# EasyEDA Pro project ProPrj_NUEDC_TI-2025_Ctrller_Pltform_2025-08-02.epro, board PCB2
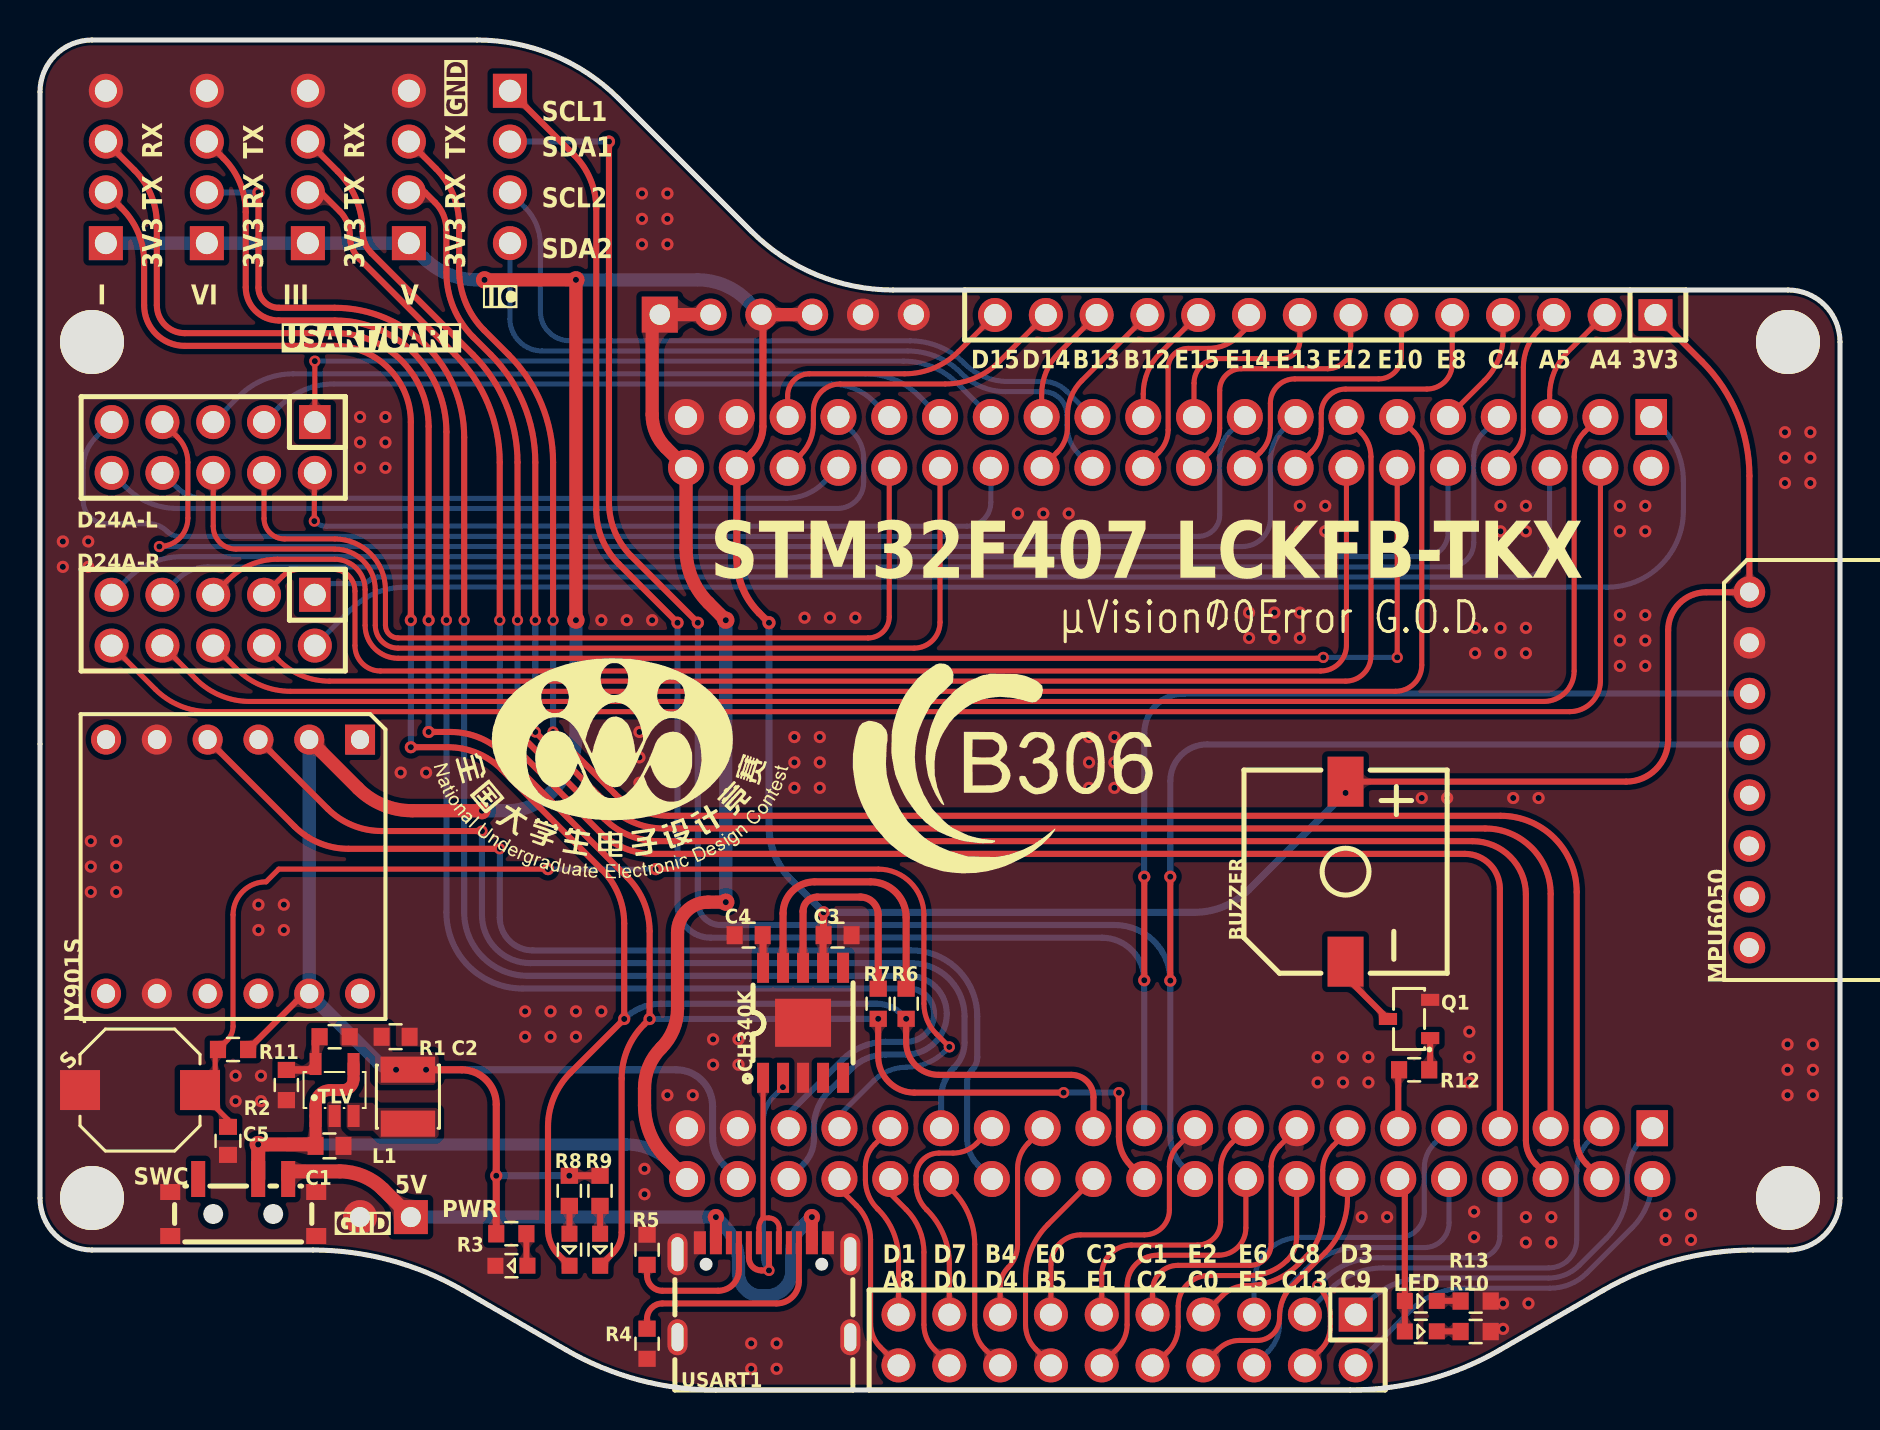
[diagram p4: board, top side]
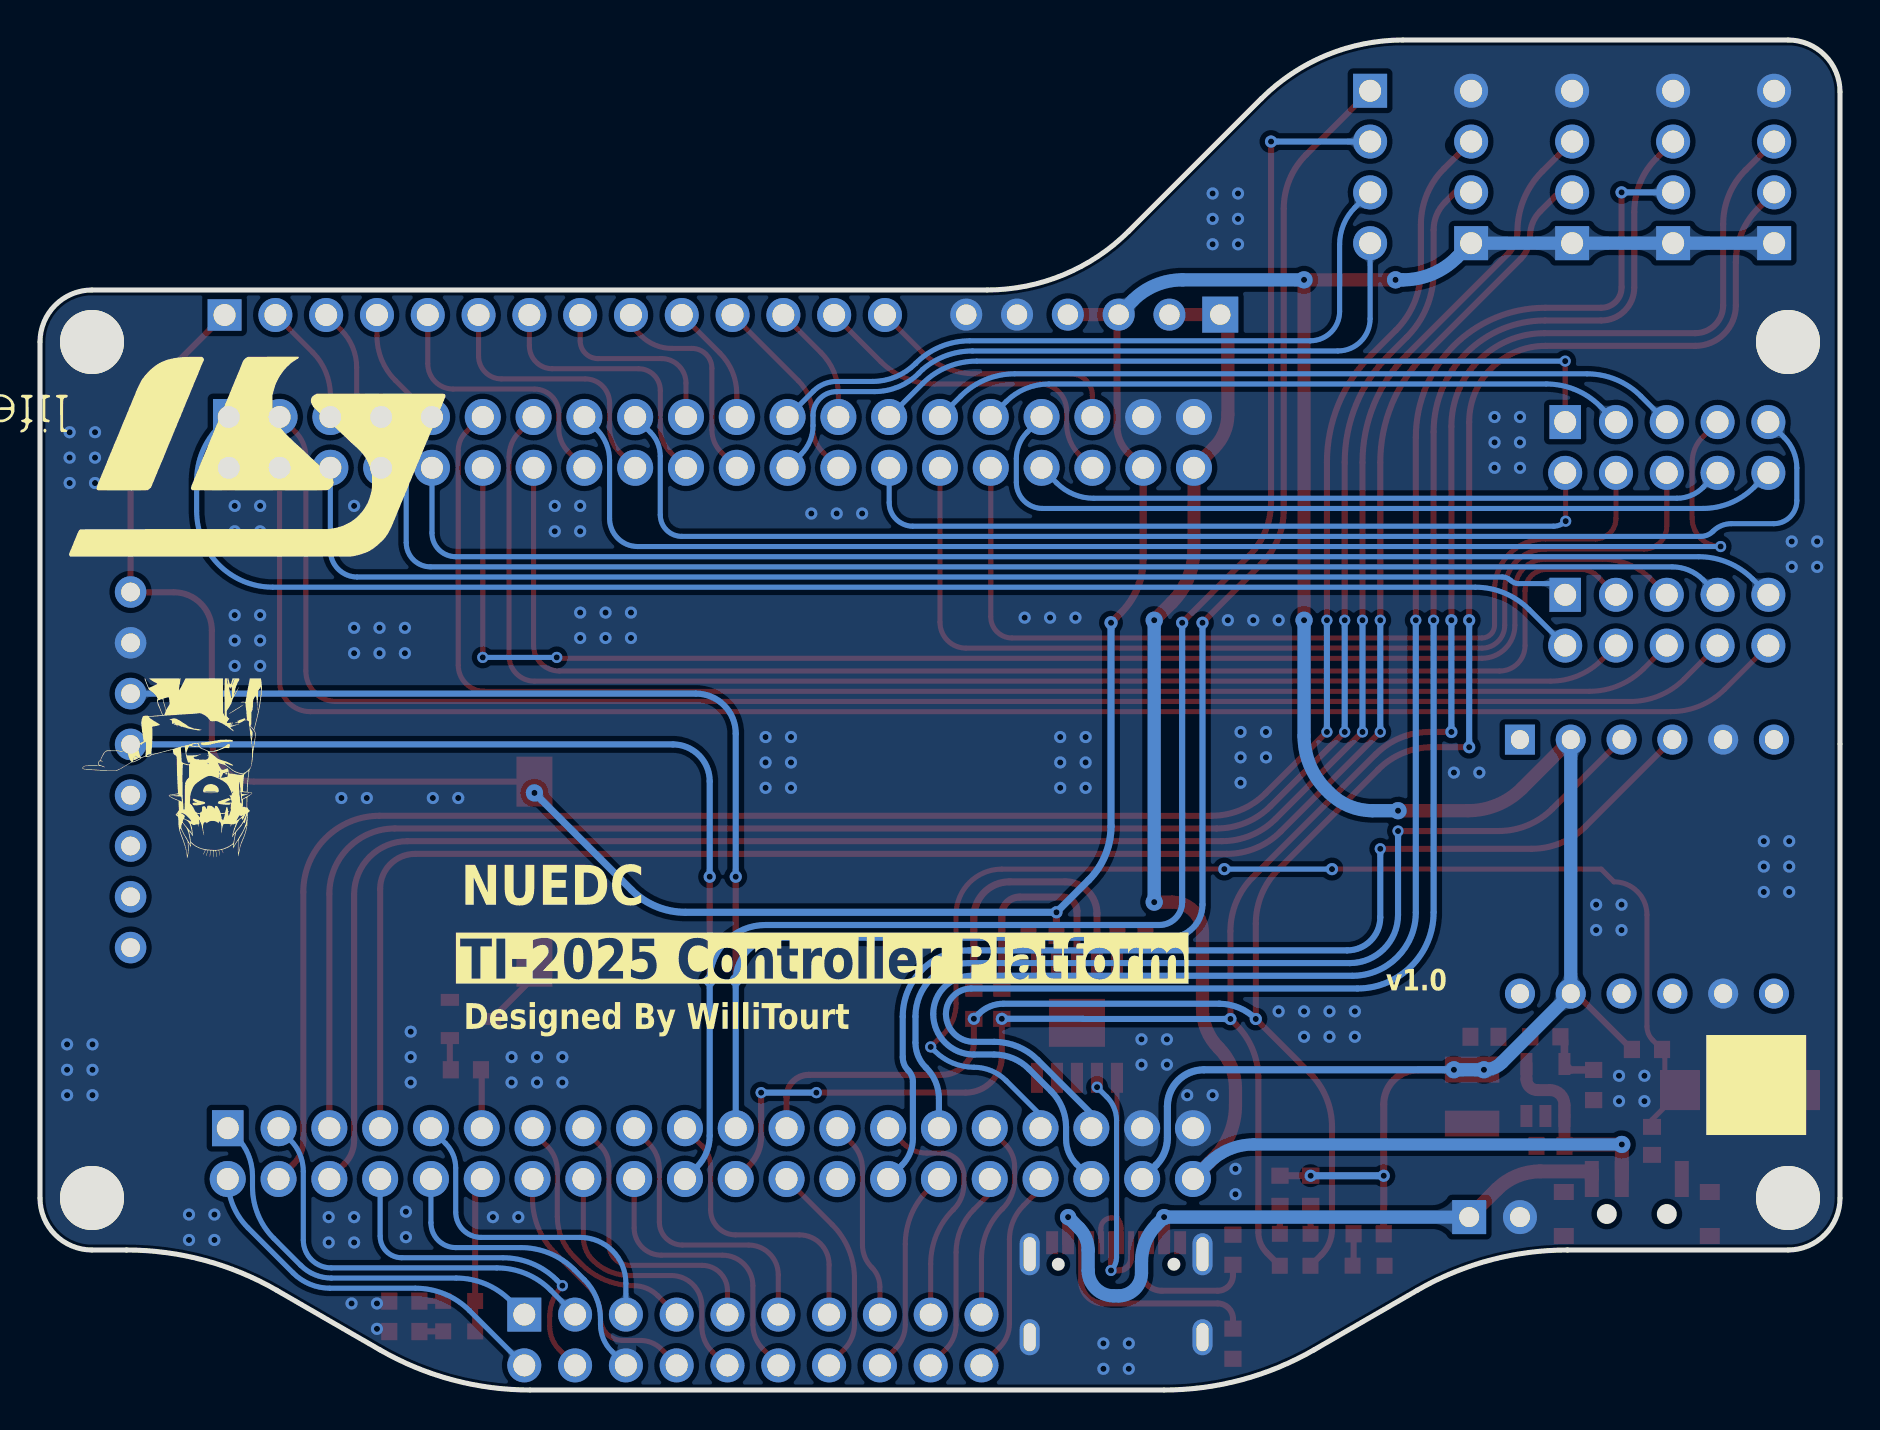
[diagram p5: board, bottom side, seen from below]

Outline 90 x 67.5 mm; copper layers: Top Layer, Bottom Layer. Coordinates in mm from the lower left corner of the outline.
Outline path: 0,64.9 arc(0.76,66.74) 2.6,67.5 21.84,67.5 arc(25.68,66.74) 28.94,64.56 35.56,57.94 arc(38.82,55.76) 42.66,55 87.4,55 arc(89.24,54.24) 90,52.4 90,9.6 arc(89.24,7.76) 87.4,7 85.67,7 arc(81.79,6.49) 78.17,4.99 73.01,2.01 arc(69.39,0.51) 65.51,0 33.79,0 arc(29.91,0.51) 26.29,2.01 21.13,4.99 arc(17.51,6.49) 13.63,7 2.6,7 arc(0.76,7.76) 0,9.6 0,64.9
Stack: Top Layer 0.035mm / Dielectric1 1.51mm FR4 er 4.5 / Bottom Layer 0.035mm

## Design rules (mm)
template: 自定义配置
spacing copperThickness1oz (default): track to track 0.102, other pairs 0.152 to 0.3
spacing copperThickness2oz: track to track 0.203, other pairs 0.152 to 0.3
track width copperThickness1oz (default): min 0.127, default 0.254, max 2.54
track width copperThickness2oz: min 0.203, default 0.254, max 2.54
differential pair differentialPair (default): width min 0.127, default 0.254, max 2.54; gap min 0.152, default 0.152
via viaSize (default): diameter min 0.5, default 0.61, max 10; hole min 0.3, default 0.305, max 6.3

## Placement (name value [footprint] x y rotation side)
BUZZER  3kHz  [BUZ-SMD_L9.6-W9.6-LS10.0-R]  65.28 25.92 90 top
C1  22uF  [C0603]  14.47 12.2 180 top
C2  22uF  [C0603]  17.78 17.66 180 top
C3  100nF  [C0603]  39.88 22.74 180 top
C4  100nF  [C0603]  35.43 22.74 180 top
C5  10uF  [C0603]  9.4 12.45 90 top
CH340K  CH340K  [ESOP-10_L4.9-W3.9-P1.00-LS6.2-BL-EP]  38.15 18.36 0 top
D24A-L  -  [HDR-TH_10P-P2.54-V-F-R2-C5-S2.54]  8.66 47.13 180 top
D24A-R  -  [HDR-TH_10P-P2.54-V-F-R2-C5-S2.54]  8.66 38.49 180 top
H1  -  [HDR-TH_14P-P2.54-V-F-1]  64.26 53.75 180 top
H2  -  [HDR-TH_20P-P2.54-V-R2-C10-S2.54]  54.36 2.5 180 top
H3  -  [HDR-TH_6P-P2.54-V-F]  37.34 53.77 0 top
IIC  -  [HDR-TH_4P-P2.54-V-F]  23.5 61.15 270 top
JY901S  -  [JY901S]  9.65 26.17 270 top
L1  2.2uH  [IND-SMD_L3.0-W3.0_FNR30XXS]  18.4 14.67 270 top
LED  -  [LED0603]  68.99 4.45 180 top
LED2  -  [LED0603]  68.99 2.92 180 top
MPU6050  -  [MPU6050]  84.2 41.5 0 top
PWR  -  [HDR-TH_2P-P2.54-V-F]  17.27 8.64 180 top
PWR#2  -  [LED0603]  23.62 6.22 0 top
Q1  S9013  [SOT-23-3_L2.9-W1.4-P1.90-LS2.6-BR]  68.45 18.55 0 top
QR  -  [JLC-QRCODE-5x5]  4.19 15.25 180 bottom
R1  453K  [R0603]  14.73 17.66 0 top
R2  100K  [R0603]  12.32 15.25 90 top
R3  4.7K  [R0603]  23.57 7.81 180 top
R4  5.1K  [R0603]  30.35 2.31 90 top
R5  5.1K  [R0603]  30.35 7.01 270 top
R6  20Ω  [R0603]  43.31 19.31 90 top
R7  20Ω  [R0603]  41.91 19.31 90 top
R8  1K  [R0603]  26.47 9.96 90 top
R9  1K  [R0603]  28 9.96 90 top
R10  1K  [R0603]  71.78 2.92 0 top
R11  10K  [R0603]  9.65 17.03 0 top
R12  1K  [R0603]  68.71 16.01 0 top
R13  1K  [R0603]  71.78 4.45 0 top
RX  -  [LED0603]  28 7.06 90 top
S  -  [6*6*5 硅胶开关]  8 11.95 180 top
SCREW1  -  [M3螺丝]  87.4 9.6 0 top
SCREW2  -  [M3螺丝]  87.4 52.4 0 top
SCREW3  -  [M3螺丝]  2.6 9.6 0 top
SCREW4  -  [M3螺丝]  2.6 52.4 0 top
SWC  MSS12C02LS-BB2.0  [SW-SMD_MSS12C02LS-HB2.0-1]  10.16 9.12 180 top
TLV  TLV62568DBVR  [SOT-23-5_L3.0-W1.7-P0.95-LS2.8-BR]  14.73 15 270 top
TX  -  [LED0603]  26.47 7.06 90 top
U1  -  [LCKFB-STM32F407-TKX]  56.46 29.6 270 top
UART5  -  [HDR-TH_4P-P2.54-V-F]  18.44 61.15 90 top
USART1  -  [USB-C-SMD_TYPE-C16PIN]  36.19 5 0 top
USART1#2  -  [HDR-TH_4P-P2.54-V-F]  3.29 61.15 90 top
USART3  -  [HDR-TH_4P-P2.54-V-F]  13.39 61.15 90 top
USART6  -  [HDR-TH_4P-P2.54-V-F]  8.34 61.15 90 top

## Footprints (pads in the part's own frame, mm; a bottom-side part is the same pattern mirrored in y, then rotated)
6*6*5 硅胶开关
  rect 2x2 smd: 1(0,-3.05) 2(6,-3.05)
BUZ-SMD_L9.6-W9.6-LS10.0-R
  rect 2.5x1.8 smd: 1(4.5,0) 2(-4.5,0)
C0603
  rect 0.8x0.9 smd: 1(-0.7,0) 2(0.7,0)
ESOP-10_L4.9-W3.9-P1.00-LS6.2-BL-EP
  rect 0.6x1.5 smd: 1(-2,-2.75) 2(-1,-2.75) 3(0,-2.75) 4(1,-2.75) 5(2,-2.75) 6(2,2.75) 7(1,2.75) 8(0,2.75) 9(-1,2.75) 10(-2,2.75)
  rect 2.8x2.4 smd: 11(0,0)
HDR-TH_2P-P2.54-V-F
  rect 1.7x1.7 hole 1: 1(-1.27,0)
  round 1.7 hole 1: 2(1.27,0)
HDR-TH_4P-P2.54-V-F
  rect 1.7x1.7 hole 1.1: 1(-3.81,0)
  round 1.7 hole 1.1: 2(-1.27,0) 3(1.27,0) 4(3.81,0)
HDR-TH_6P-P2.54-V-F
  rect 1.8x1.8 hole 1.02: 1(-6.35,0)
  round 1.6 hole 1.02: 2(-3.81,0) 3(-1.27,0) 4(1.27,0) 5(3.81,0) 6(6.35,0)
HDR-TH_10P-P2.54-V-F-R2-C5-S2.54
  rect 1.575x1.7 hole 1.1: 1(-5.08,-1.27)
  round 1.7 hole 1.1: 2(-5.08,1.27) 3(-2.54,-1.27) 4(-2.54,1.27) 5(0,-1.27) 6(0,1.27) 7(2.54,-1.27) 8(2.54,1.27) 9(5.08,-1.27) 10(5.08,1.27)
HDR-TH_14P-P2.54-V-F-1
  rect 1.7x1.575 hole 1.1: 1(-16.51,0)
  round 1.7 hole 1.1: 2(-13.97,0) 3(-11.43,0) 4(-8.89,0) 5(-6.35,0) 6(-3.81,0) 7(-1.27,0) 8(1.27,0) 9(3.81,0) 10(6.35,0) 11(8.89,0) 12(11.43,0) 13(13.97,0) 14(16.51,0)
HDR-TH_20P-P2.54-V-R2-C10-S2.54
  rect 1.7x1.7 hole 1.1: 1(-11.43,-1.27)
  round 1.7 hole 1.1: 2(-11.43,1.27) 3(-8.89,-1.27) 4(-8.89,1.27) 5(-6.35,-1.27) 6(-6.35,1.27) 7(-3.81,-1.27) 8(-3.81,1.27) 9(-1.27,-1.27) 10(-1.27,1.27) 11(1.27,-1.27) 12(1.27,1.27) 13(3.81,-1.27) 14(3.81,1.27) 15(6.35,-1.27) 16(6.35,1.27) 17(8.89,-1.27) 18(8.89,1.27) 19(11.43,-1.27) 20(11.43,1.27)
IND-SMD_L3.0-W3.0_FNR30XXS
  rect 1.3x2.72 smd: 1(1.35,0) 2(-1.35,0)
JY901S
  rect 1.501x1.501 hole 0.945x0.899: 1(-6.35,6.35)
  round 1.501 hole 0.945x0.899: 2(-6.35,3.81) 3(-6.35,1.27) 4(-6.35,-1.27) 5(-6.35,-3.81) 6(-6.35,-6.35) 7(6.35,6.35) 8(6.35,3.81) 9(6.35,1.27) 10(6.35,-1.27) 11(6.35,-3.81) 12(6.35,-6.35)
LCKFB-STM32F407-TKX
  rect 1.8x1.575 hole 1.1: 1(-19.05,24.105) 41(16.51,24.155)
  round 1.8 hole 1.1: 2(-16.51,24.105) 3(-19.05,21.564) 4(-16.51,21.564) 5(-19.05,19.024) 6(-16.51,19.024) 7(-19.05,16.485) 8(-16.51,16.485) 9(-19.05,13.944) 10(-16.51,13.944) 11(-19.05,11.405) 12(-16.51,11.405) 13(-19.05,8.864) 14(-16.51,8.864) 15(-19.05,6.324) 16(-16.51,6.324) 17(-19.05,3.784) 18(-16.51,3.784) 19(-19.05,1.244) 20(-16.51,1.244) 21(-19.05,-1.296) 22(-16.51,-1.296) 23(-19.05,-3.836) 24(-16.51,-3.836) 25(-19.05,-6.375) 26(-16.51,-6.375) 27(-19.05,-8.915) 28(-16.51,-8.915) 29(-19.05,-11.456) 30(-16.51,-11.456) 31(-19.05,-13.995) 32(-16.51,-13.995) 33(-19.05,-16.535) 34(-16.51,-16.535) 35(-19.05,-19.076) 36(-16.51,-19.076) 37(-19.05,-21.616) 38(-16.51,-21.616) 39(-19.05,-24.155) 40(-16.51,-24.155) 42(19.05,24.155) 43(16.51,21.616) 44(19.05,21.616) 45(16.51,19.076) 46(19.05,19.076) 47(16.51,16.535) 48(19.05,16.535) 49(16.51,13.995) 50(19.05,13.995) 51(16.51,11.456) 52(19.05,11.456) 53(16.51,8.915) 54(19.05,8.915) 55(16.51,6.375) 56(19.05,6.375) 57(16.51,3.836) 58(19.05,3.836) 59(16.51,1.296) 60(19.05,1.296) 61(16.51,-1.244) 62(19.05,-1.244) 63(16.51,-3.784) 64(19.05,-3.784) 65(16.51,-6.324) 66(19.05,-6.324) 67(16.51,-8.864) 68(19.05,-8.864) 69(16.51,-11.405) 70(19.05,-11.405) 71(16.51,-13.944) 72(19.05,-13.944) 73(16.51,-16.485) 74(19.05,-16.485) 75(16.51,-19.024) 76(19.05,-19.024) 77(16.51,-21.564) 78(19.05,-21.564) 79(16.51,-24.105) 80(19.05,-24.105)
LED0603
  rect 0.8x0.8 smd: 1(-0.851,-0.01) 2(0.75,-0.005)
M3螺丝
  round 3.2 hole 3.2: 1(0,0)
MPU6050
  round 1.575 hole 0.94: 1(1.27,-1.6) 2(1.27,-4.14) 3(1.27,-6.68) 4(1.27,-9.22) 5(1.27,-11.76) 6(1.27,-14.3) 7(1.27,-16.84) 8(1.27,-19.38)
R0603
  rect 0.806x0.864 smd: 1(-0.753,0) 2(0.753,0)
SOT-23-3_L2.9-W1.4-P1.90-LS2.6-BR
  rect 0.91x0.6 smd: 1(1.055,-0.955) 2(1.055,0.955) 3(-1.055,0)
SOT-23-5_L3.0-W1.7-P0.95-LS2.8-BR
  rect 1.1x0.6 smd: 1(1.3,-0.95) 2(1.3,0) 3(1.3,0.95) 4(-1.3,0.95) 5(-1.3,-0.95)
SW-SMD_MSS12C02LS-HB2.0-1
  rect 0.7x1.8 smd: 1(-2.25,-1.425) 2(-0.75,-1.425) 3(2.25,-1.425)
  rect 1x0.8 smd: 4(-3.65,1.425) 4(-3.65,-0.775) 4(3.65,1.425) 4(3.65,-0.775)
USB-C-SMD_TYPE-C16PIN
  oval 1x2.1 hole 0.6x1.7: 1(-4.32,1.788) 2(4.32,1.788)
  oval 1x1.8 hole 0.6x1.4: 3(-4.32,-2.362) 4(4.32,-2.362)
  rect 0.6x1.15 smd: A1B12(-3.2,2.362) A4B9(-2.4,2.362) B1A12(3.2,2.362) B4A9(2.4,2.362)
  rect 0.3x1.15 smd: A5(-1.25,2.362) A6(-0.25,2.362) A7(0.25,2.362) A8(1.25,2.362) B5(1.75,2.362) B6(0.75,2.362) B7(-0.75,2.362) B8(-1.75,2.362)

## Nets
3V3: BUZZER.1 C2.2 C3.2 CH340K.7 H1.1 H3.3 H3.4 JY901S.2 JY901S.8 L1.2 MPU6050.1 R1.2 R3.2 R8.2 R9.2 R11.2 U1.38 U1.78 UART5.1 USART1#2.1 USART3.1 USART6.1
5V: C1.2 H3.1 H3.2 SWC.2 TLV.1 TLV.4 U1.40 U1.80
5VIN: PWR.1 SWC.1 USART1.A4B9 USART1.B4A9
GND: C1.1 C2.1 C3.1 C4.2 C5.1 CH340K.3 CH340K.11 H3.5 H3.6 JY901S.5 JY901S.11 MPU6050.2 PWR.2 PWR#2.1 Q1.2 R2.1 R4.1 R5.1 R10.2 R13.2 S.2 SCREW1.1 SCREW2.1 SCREW3.1 SCREW4.1 SWC.4 TLV.2 U1.37 U1.39 U1.77 U1.79 UART5.4 USART1.1 USART1.2 USART1.3 USART1.4 USART1.A1B12 USART1.B1A12 USART1#2.4 USART3.4 USART6.4
A4: H1.2 U1.5
A5: H1.3 U1.8
A8: H2.20 U1.74
B4: H2.15 U1.65
B5: H2.14 U1.64
B12: H1.11 U1.26
B13: H1.12 U1.25
BUZZER: R12.1 U1.51
C0: H2.8 U1.54
C1: H2.9 U1.55
C2: H2.10 U1.56
C3: H2.11 U1.57
C4: H1.4 U1.9
C8: H2.3 U1.43
C9: H2.2 U1.42
C13: H2.4 U1.48
D0: H2.18 U1.72
D1: H2.19 U1.71
D3: H2.1 U1.41
D4: H2.16 U1.70
D7: H2.17 U1.67
D14: H1.13 U1.36
D15: H1.14 U1.35
DIR.BL.IN1: D24A-L.6 U1.30
DIR.BL.IN2: D24A-L.4 U1.32
DIR.BR.IN1: D24A-R.5 U1.12
DIR.BR.IN2: D24A-R.3 U1.14
DIR.FL.IN1: D24A-L.5 U1.29
DIR.FL.IN2: D24A-L.3 U1.31
DIR.FR.IN1: D24A-R.6 U1.11
DIR.FR.IN2: D24A-R.4 U1.13
E0: H2.13 U1.59
E1: H2.12 U1.58
E2: H2.7 U1.53
E5: H2.6 U1.50
E6: H2.5 U1.49
E8: H1.5 U1.16
E10: H1.6 U1.18
E12: H1.7 U1.20
E13: H1.8 U1.19
E14: H1.9 U1.22
E15: H1.10 U1.21
ENC.BL.A: D24A-L.8 U1.34
ENC.BL.B: D24A-L.10 U1.33
ENC.BR.A: D24A-R.7 U1.7
ENC.BR.B: D24A-R.9 U1.10
ENC.FL.A: D24A-L.7 U1.15
ENC.FL.B: D24A-L.9 U1.17
ENC.FR.A: D24A-R.8 U1.3
ENC.FR.B: D24A-R.10 U1.4
I2C1.SCL: IIC.1 MPU6050.3 U1.61
I2C1.SDA: IIC.2 MPU6050.4 U1.60
I2C2.SCL: IIC.3 U1.23
I2C2.SDA: IIC.4 U1.24
LED: LED.2 LED2.2 U1.52
PWM0: D24A-L.2 U1.28
PWM1: D24A-L.1 U1.27
PWM2: D24A-R.2 U1.1
PWM3: D24A-R.1 U1.6
S: C5.2 R11.1 S.1 U1.73
UART5.RX: U1.45 UART5.2
UART5.TX: U1.44 UART5.3
UD+: CH340K.1 USART1.A6 USART1.B6
UD-: CH340K.2 USART1.A7 USART1.B7
USART1.RX: R7.1 RX.1 U1.62 USART1#2.3
USART1.TX: R6.1 TX.1 U1.63 USART1#2.2
USART2.RX: JY901S.4 U1.68
USART2.TX: JY901S.3 U1.69
USART3.RX: U1.46 USART3.3
USART3.TX: U1.47 USART3.2
USART6.RX: U1.76 USART6.2
USART6.TX: U1.75 USART6.3
$1N2281: C4.1 CH340K.10
$1N2282: CH340K.9 R6.2
$1N2283: CH340K.8 R7.2
$1N2289: R8.1 TX.2
$1N2292: R9.1 RX.2
$1N2301: R4.2 USART1.B5
$1N2302: R5.2 USART1.A5
$1N2368: LED.1 R13.1
$1N2391: BUZZER.2 Q1.3
$1N2476: LED2.1 R10.1
$1N2481: Q1.1 R12.2
$1N2556: R1.1 R2.2 TLV.5
$1N2557: PWR#2.2 R3.1
$1N2559: L1.1 TLV.3

Pads without a net: CH340K 4 5 6; JY901S 1 6 7 9 10 12; MPU6050 5 6 7 8; SWC 3; U1 2 66; USART1 A8 B8

## Via types
v1: diameter 0.864, hole 0.305, Top Layer to Bottom Layer, 10 vias
v2: diameter 0.61, hole 0.305, Top Layer to Bottom Layer, 168 vias
v3: diameter 0.66, hole 0.305, Top Layer to Bottom Layer, 1 via
v4: diameter 0.559, hole 0.305, Top Layer to Bottom Layer, 23 vias
v5: diameter 0.813, hole 0.305, Top Layer to Bottom Layer, 2 vias

## Routing (per net, layer and track width the routed paths; a pad name or vN(x,y) marks a point on that pad's centre or on a via; arc(x,y) is an arc through that point)
3V3: length 243.3
  Top Layer w0.305: R11.2 13.01,19.64 arc(13.22,19.77) 13.46,19.82 ; BUZZER.1 79.3,30.42 arc(80.79,31.03) 81.41,32.52 81.41,37.98 arc(81.96,39.33) 83.31,39.89 85.46,39.89 arc(85.47,39.89) MPU6050.1 85.47,45.7 arc(84.86,48.8) 83.1,51.42 H1.1
  Top Layer w0.355: v2(39.18,23.89) C3.2 arc(39.16,22.71) 39.15,22.68 CH340K.7 ; R3.2 v2(22.81,10.71) 22.81,14.28 arc(22.31,15.5) 21.08,16.01 v1(19.3,16.01) 18.4,16.01 arc(18.4,16.01) L1.2 ; v3(36.45,38.36) 35.96,38.85 arc(35.13,40.09) 34.84,41.55 U1.38 35.61,46.87 arc(36.01,47.47) 36.15,48.18 36.15,53.58 arc(36.13,53.68) H3.3 ; v2(26.47,10.71) 28,10.71
  Top Layer w0.66: H3.3 H3.4 ; v1(22.1,28.97) 18.6,28.97 arc(17.14,29.26) 15.9,30.08 JY901S.2 ; v1(22.22,55.51) v1(26.8,55.51) v1(26.8,38.49)
  Bottom Layer w0.355: v3(36.45,38.36) 36.45,28.19 arc(36.74,26.73) 37.56,25.5 v2(39.18,23.89) 57.73,23.89 arc(59.19,24.18) 60.43,25 v1(65.28,29.85) ; U1.78 34.19,11.25 arc(33.78,11.87) 33.63,12.61 33.63,14.19 arc(33.1,15.48) 31.81,16.01 v1(19.3,16.01) ; v2(22.81,10.71) v2(26.47,10.71)
  Bottom Layer w0.66: v1(22.22,55.51) 21.86,55.51 arc(20.4,55.8) 19.16,56.62 UART5.1 USART3.1 USART6.1 USART1#2.1 ; JY901S.2 13.46,19.82 16.9,16.39 arc(17.31,16.11) v1(17.8,16.01) v1(19.3,16.01) ; v1(22.1,28.97) 23.38,28.97 arc(24.54,29.2) 25.53,29.85 25.68,30.01 arc(26.51,31.24) 26.8,32.7 v1(26.8,38.49) ; v1(26.8,55.51) 32.88,55.51 arc(34.22,55.24) 35.35,54.48 H3.3
5V: length 82.2
  Top Layer w0.6: 15.68,16.3 15.68,15.54 arc(15.52,15.16) 15.13,15 14.5,15 arc(13.99,14.78) 13.78,14.27 TLV.1 13.78,12.21 arc(13.78,12.21) C1.2
  Top Layer w0.66: v1(34.29,24.39) 33.4,24.39 arc(32.32,23.95) 31.88,22.87 31.88,19.07 arc(31.66,18) 31.06,17.1 arc(30.44,16.18) 30.23,15.09 30.23,14.23 arc(30.51,12.8) 31.33,11.58 U1.80 ; v1(34.29,38.49) 33.42,39.36 arc(32.59,40.6) 32.3,42.06 U1.40 31.29,47.12 arc(30.79,47.88) 30.61,48.78 30.61,53.39 H3.1 H3.2
  Top Layer w0.701: SWC.2 v1(10.91,12.28) 13.7,12.28 arc(13.75,12.26) C1.2
  Bottom Layer w0.61: v1(10.91,12.28) 29.32,12.28 arc(30.53,12.04) 31.55,11.35 U1.80
  Bottom Layer w0.66: v1(34.29,38.49) v1(34.29,24.39)
5VIN: length 35.4
  Top Layer w0.6: USART1.A4B9 v5(33.79,8.64) ; USART1.B4A9 v5(38.59,8.64)
  Top Layer w0.701: PWR.1 17.15,10.03 arc(16.16,10.7) 14.99,10.93 12.41,10.93 SWC.1
  Bottom Layer w0.66: PWR.1 v5(33.79,8.64) arc(33.8,8.63) 33.8,8.62 34.16,8.26 arc(34.73,7.42) 34.93,6.42 34.93,5.85 arc(35.26,5.04) 36.07,4.71 36.32,4.71 arc(37.22,5.08) 37.59,5.98 37.59,6.99 arc(37.71,7.59) 38.05,8.1 v5(38.59,8.64)
GND:
  vias: v2(1.14,42.43) v2(1.14,41.16) v2(2.41,42.43) v2(2.41,41.16) v2(2.54,27.44) v2(2.54,26.17) v2(2.54,24.9) v2(3.81,27.44) v2(3.81,26.17) v2(3.81,24.9) v2(9.78,15.71) v2(9.78,14.44) v2(10.92,24.27) v2(10.92,23) v2(11.05,15.71) v2(11.05,14.44) v2(12.19,24.27) v2(12.19,23) v2(16,48.65) v2(16,47.38) v2(16,46.11) v2(17.27,48.65) v2(17.27,47.38) v2(17.27,46.11) v2(18.03,30.87) v2(19.3,30.87) v2(24.26,18.93) v2(24.26,17.66) v2(25.53,18.93) v2(25.53,17.66) v2(26.8,18.93) v2(26.8,17.66) v2(28.07,38.49) v2(28.07,18.93) v2(28.7,32.9) v2(28.7,31.63) v2(29.34,38.49) v2(29.97,32.9) v2(29.97,31.63) v2(29.97,30.36) v2(30.1,59.83) v2(30.1,58.56) v2(30.1,57.29) v2(30.23,11.06) v2(30.23,9.79) v2(30.61,38.49) v2(31.37,59.83) v2(31.37,58.56) v2(31.37,57.29) v2(31.37,14.74) v2(32.64,14.74) v2(33.66,17.53) v2(33.66,16.27) v2(34.93,17.53) v2(34.93,16.27) v2(35.56,2.33) v2(35.56,1.06) v2(36.83,2.33) v2(36.83,1.06) v2(37.72,32.65) v2(37.72,31.38) v2(37.72,30.11) v2(38.23,38.62) v2(38.99,32.65) v2(38.99,31.38) v2(38.99,30.11) v2(39.5,38.62) v2(40.77,38.62) v2(48.9,43.82) v2(50.16,43.82) v2(51.44,43.82) v2(52.45,32.65) v2(52.45,31.38) v2(52.45,30.11) v2(53.72,32.65) v2(53.72,31.38) v2(53.72,30.11) v2(60.45,38.87) v2(60.45,37.6) v2(61.72,38.87) v2(61.72,37.6) v2(62.99,44.2) v2(62.99,42.94) v2(62.99,38.87) v2(62.99,37.6) v2(63.88,16.65) v2(63.88,15.38) v2(64.26,44.2) v2(64.26,42.94) v2(65.15,16.65) v2(65.15,15.38) v2(66.09,8.64) v2(66.42,16.65) v2(66.42,15.38) v2(67.36,8.64) v2(69.09,29.6) v2(70.36,29.6) v2(71.47,17.92) v2(71.47,16.65) v2(71.47,15.38) v2(71.71,8.91) v2(71.71,7.64) v2(71.75,38.11) v2(71.75,36.84) v2(73.03,44.2) v2(73.03,42.94) v2(73.03,38.11) v2(73.03,36.84) v2(73.15,4.33) v2(73.15,3.06) v2(73.66,29.6) v2(74.29,44.2) v2(74.29,42.94) v2(74.29,38.11) v2(74.29,36.84) v2(74.29,8.64) v2(74.29,7.38) v2(74.42,4.33) v2(74.93,29.6) v2(75.56,8.64) v2(75.56,7.38) v2(78.99,44.2) v2(78.99,42.94) v2(78.99,38.74) v2(78.99,37.47) v2(78.99,36.2) v2(80.26,44.2) v2(80.26,42.94) v2(80.26,38.74) v2(80.26,37.47) v2(80.26,36.2) v2(81.28,8.77) v2(81.28,7.5) v2(82.55,8.77) v2(82.55,7.5) v2(87.25,47.89) v2(87.25,46.62) v2(87.25,45.35) v2(87.38,17.28) v2(87.38,16.01) v2(87.38,14.74) v2(88.52,47.89) v2(88.52,46.62) v2(88.52,45.35) v2(88.65,17.28) v2(88.65,16.01) v2(88.65,14.74)
A4: length 6.1
  Top Layer w0.254: H1.2 76.37,51.89 arc(75.71,50.9) 75.48,49.74 U1.5
A5: length 8.6
  Top Layer w0.254: U1.8 73.69,46.86 arc(74.04,47.39) 74.17,48.02 74.17,51.13 arc(74.37,52.14) 74.94,53 H1.3
A8: length 10.3
  Top Layer w0.254: H2.20 42.01,2.14 arc(41.65,2.68) 41.53,3.31 41.53,7.52 arc(41.34,8.44) 40.82,9.23 40.31,9.74 arc(40.06,10.11) U1.74
B4: length 10
  Top Layer w0.254: H2.15 48.01,5.15 arc(48.11,5.68) 48.41,6.13 arc(48.76,6.65) 48.88,7.26 48.88,11.06 arc(49.01,11.75) 49.4,12.33 50.11,13.04 arc(50.13,13.06) U1.65
B5: length 11
  Top Layer w0.254: U1.64 50.39,8.27 arc(49.57,7.03) 49.28,5.57 49.28,3.28 arc(49.41,2.6) 49.79,2.04 50.51,1.31 arc(50.54,1.28) H2.14
B12: length 9.6
  Top Layer w0.254: U1.26 50.85,46.88 arc(51.24,47.46) 51.37,48.14 51.37,48.74 arc(51.56,49.68) 52.09,50.47 H1.11
B13: length 6.1
  Top Layer w0.254: U1.25 50.08,49.77 arc(50.31,50.91) 50.95,51.87 H1.12
BUZZER: length 2.9
  Top Layer w0.305: U1.51 67.91,15.91 arc(67.92,15.97) R12.1
C0: length 13
  Top Layer w0.254: 65.37,10.55 65.37,9.56 arc(65.08,8.1) 64.26,6.86 62.6,5.21 arc(62.14,4.51) 61.98,3.69 61.98,3.59 arc(61.65,2.8) 60.87,2.48 59.98,2.48 arc(59.41,2.36) 58.93,2.04 58.2,1.31 arc(58.18,1.28) H2.8
C1: length 14.7
  Top Layer w0.254: H2.9 55.63,4.96 arc(56,5.86) 56.9,6.23 60.5,6.23 arc(61.24,6.54) 61.55,7.29 61.55,11.18 arc(61.66,11.73) 61.98,12.2 62.81,13.04 arc(62.83,13.06) U1.55
C2: length 14.2
  Top Layer w0.254: U1.56 62.83,7.64 arc(62.71,7.01) 62.36,6.49 arc(61.51,5.92) 60.52,5.72 58.44,5.72 arc(57.36,5.28) 56.91,4.19 56.91,3.17 arc(56.77,2.49) 56.39,1.91 55.76,1.28 arc(55.7,1.24) H2.10
C3: length 14.6
  Top Layer w0.254: H2.11 53.09,5.76 arc(53.52,6.81) 54.57,7.25 57.88,7.25 arc(58.69,7.59) 59.03,8.4 59.03,11.05 arc(59.17,11.74) 59.56,12.33 60.27,13.04 arc(60.29,13.06) U1.57
C4: length 6.1
  Top Layer w0.254: U1.9 72.24,50.48 arc(72.91,51.5) 73.15,52.7 H1.4
C8: length 21.2
  Bottom Layer w0.254: H2.3 64.47,4.99 arc(65.7,5.81) 67.16,6.1 75.44,6.1 arc(76.43,6.51) 76.84,7.5 76.84,10.93 arc(77,11.78) 77.49,12.5 U1.43
C9: length 19.1
  Bottom Layer w0.254: H2.2 68.53,3.97 arc(69.76,4.8) 71.22,5.09 75.5,5.09 arc(76.5,5.29) 77.34,5.85 79.6,8.11 arc(80.35,9.23) U1.42
C13: length 17.6
  Top Layer w0.254: H2.4 64.03,2.02 arc(64.39,2.55) 64.52,3.18 64.52,3.68 arc(64.35,4.51) v4(63.88,5.22)
  Bottom Layer w0.254: U1.48 72.99,7.69 arc(72.68,6.93) 71.92,6.61 66.86,6.61 arc(65.4,6.32) 64.16,5.5 v4(63.88,5.22)
D0: length 10.3
  Top Layer w0.254: U1.72 42.51,9.82 43.31,9.03 arc(43.96,8.04) 44.2,6.88 44.2,3.27 arc(44.33,2.6) 44.7,2.04 45.43,1.31 arc(45.46,1.28) H2.18
D1: length 10.2
  Top Layer w0.254: H2.19 42.93,6.57 arc(42.66,7.9) 41.91,9.03 41.87,9.07 arc(41.42,9.73) 41.27,10.51 41.27,11.16 arc(41.39,11.77) 41.73,12.28 42.49,13.04 arc(42.51,13.06) U1.71
D3: length 20
  Bottom Layer w0.254: U1.41 80.19,12.66 arc(79.59,11.76) 79.38,10.7 79.38,10.15 arc(79.1,8.76) 78.31,7.58 76.96,6.23 arc(76.26,5.76) 75.43,5.6 69.19,5.6 arc(67.73,5.31) 66.5,4.48 H2.1
D4: length 10.3
  Top Layer w0.254: U1.70 45.62,9.98 arc(46.45,8.75) 46.74,7.29 46.74,3.27 arc(46.87,2.6) 47.24,2.04 47.97,1.31 arc(48,1.28) H2.16
D7: length 12.3
  Top Layer w0.254: 47.59,13.09 46.84,12.33 arc(46.3,11.97) 45.66,11.85 44.95,11.85 arc(44.14,11.51) 43.81,10.71 43.81,10.27 arc(43.94,9.6) 44.32,9.03 44.35,9 arc(45.18,7.76) 45.47,6.31 H2.17
D14: length 16.9
  Top Layer w0.254: H1.13 47.96,51.42 arc(46.72,50.59) 45.26,50.3 40,50.3 arc(39.06,49.91) 38.67,48.97 38.67,48.3 arc(38.5,47.47) 38.03,46.76 U1.36
D15: length 13.1
  Top Layer w0.254: U1.35 37.38,49.72 arc(37.7,50.49) 38.47,50.81 43.23,50.81 arc(44.69,51.1) 45.93,51.92 H1.14
DIR.BL.IN1: length 51.7
  Top Layer w0.254: U1.30 45,38.39 arc(44.62,37.47) 43.7,37.09 17.91,37.09 arc(17.1,37.43) 16.76,38.24 16.76,40.01 arc(16.17,41.45) 14.73,42.05 9.8,42.05 arc(8.99,42.38) 8.66,43.18 D24A-L.6
DIR.BL.IN2: length 45.8
  Top Layer w0.254: U1.32 42.46,38.66 arc(42.15,37.91) 41.4,37.6 17.91,37.6 arc(17.46,37.79) 17.27,38.24 17.27,40.01 arc(16.53,41.81) 14.73,42.55 12.22,42.55 arc(11.5,42.85) 11.2,43.58 D24A-L.4
DIR.BR.IN1: length 72.9
  Top Layer w0.254: U1.12 v4(67.86,36.63) ; D24A-R.5 9.42,40.52 arc(10.55,41.27) 11.87,41.54 14.73,41.54 arc(15.81,41.09) 16.26,40.01 16.26,38.24 arc(16.74,37.07) 17.91,36.58 64.12,36.58 arc(64.15,36.6) v4(64.16,36.63)
  Bottom Layer w0.254: v4(64.16,36.63) v4(67.86,36.63)
DIR.BR.IN2: length 68.3
  Top Layer w0.254: D24A-R.3 12.13,40.69 arc(12.2,40.75) 12.27,40.81 arc(12.59,40.97) 12.95,41.03 14.67,41.03 arc(15.43,40.71) 15.75,39.95 15.75,37.22 arc(16.12,36.32) 17.02,35.95 64.04,35.95 arc(64.95,36.33) 65.32,37.24 U1.14
DIR.FL.IN1: length 37.9
  Bottom Layer w0.254: D24A-L.5 9.96,49.69 arc(11.19,50.52) 12.65,50.81 41.26,50.81 arc(42.72,50.52) 43.96,49.69 U1.29
DIR.FL.IN2: length 32.4
  Bottom Layer w0.254: U1.31 41.7,49.42 arc(40.72,50.07) 39.56,50.3 14.68,50.3 arc(13.23,50.01) 11.99,49.19 D24A-L.3
DIR.FR.IN1: length 74.9
  Top Layer w0.254: D24A-R.6 9.83,36.05 arc(11.07,35.22) 12.53,34.93 67.78,34.93 arc(68.7,35.32) 69.09,36.24 69.09,46.97 arc(68.99,47.47) 68.71,47.89 68,48.59 arc(67.94,48.63) U1.11
DIR.FR.IN2: length 69
  Top Layer w0.254: D24A-R.4 11.92,36.5 arc(13.09,35.72) 14.47,35.44 65.28,35.44 arc(66.18,35.81) 66.55,36.71 66.55,46.66 arc(66.42,47.33) 66.04,47.89 65.35,48.57 arc(65.33,48.61) U1.13
E0: length 14.5
  Top Layer w0.254: H2.13 50.55,6.27 arc(50.98,7.32) 52.03,7.76 55.22,7.76 arc(56.1,8.12) 56.47,9 56.47,11.17 arc(56.58,11.73) 56.9,12.2 57.73,13.04 arc(57.75,13.06) U1.59
E1: length 14.5
  Top Layer w0.254: U1.58 60.29,8.11 arc(59.89,7.14) 58.93,6.74 55.88,6.74 arc(54.8,6.29) 54.36,5.22 54.36,3.27 arc(54.22,2.6) 53.85,2.04 53.12,1.31 arc(53.1,1.28) H2.12
E2: length 13.2
  Top Layer w0.254: H2.7 59.11,4.71 arc(59.67,5.09) 60.32,5.22 arc(61.73,5.5) 62.93,6.29 63.31,6.68 arc(63.92,7.59) 64.13,8.67 64.13,10.97 arc(64.27,11.64) 64.64,12.2 65.26,12.82 arc(65.34,12.94) 65.37,13.09
E5: length 16
  Bottom Layer w0.254: H2.6 61.42,1.94 arc(61.83,2.56) 61.98,3.29 61.98,3.56 arc(62.19,4.62) 62.78,5.52 63.27,6 arc(64.51,6.83) 65.97,7.12 69.22,7.12 arc(70.09,7.48) 70.45,8.36 U1.50
E6: length 16.7
  Bottom Layer w0.254: H2.5 60.71,5.34 arc(61.38,6.96) 62.99,7.63 67.94,7.63 arc(68.84,8) 69.22,8.9 69.22,11.1 arc(69.35,11.77) 69.72,12.33 70.43,13.04 arc(70.45,13.06) U1.49
E8: length 13.6
  Top Layer w0.254: H1.5 70.61,51.32 arc(70.24,50.42) 69.34,50.05 65.28,50.05 arc(64.42,49.69) 64.06,48.83 64.06,48.07 arc(63.94,47.44) 63.58,46.91 U1.16
E10: length 13.6
  Top Layer w0.254: U1.18 61.02,46.89 arc(61.39,47.44) 61.52,48.09 61.52,49.34 arc(61.88,50.2) 62.74,50.56 66.93,50.56 arc(67.74,50.89) 68.07,51.7 H1.6
E12: length 13.7
  Top Layer w0.254: U1.20 58.49,46.9 arc(58.86,47.44) 58.98,48.09 58.98,49.98 arc(59.3,50.74) 60.07,51.06 64.39,51.06 arc(65.2,51.4) 65.53,52.21 H1.7
E13: length 9.5
  Top Layer w0.254: U1.19 57.7,50.34 arc(58.06,51.21) 58.93,51.57 62.1,51.57 arc(62.73,51.83) 62.99,52.46 H1.8
E14: length 10.9
  Top Layer w0.254: H1.9 60.45,53.22 59.94,52.71 arc(59.24,52.24) 58.41,52.08 57.4,52.08 arc(56.7,51.79) 56.41,51.08 56.41,48.01 arc(56.29,47.4) 55.94,46.89 U1.22
E15: length 6.1
  Top Layer w0.254: U1.21 55.16,49.81 arc(55.38,50.91) 56,51.84 H1.10
ENC.BL.A: length 34.8
  Bottom Layer w0.254: U1.34 39.16,45.35 arc(38.32,44.78) 37.32,44.59 8.16,44.59 arc(7.45,44.73) 6.85,45.13 D24A-L.8
ENC.BL.B: length 42.6
  Bottom Layer w0.254: D24A-L.10 4.3,45.14 arc(5.47,44.35) 6.86,44.08 39.88,44.08 arc(40.8,44.46) 41.18,45.38 41.18,46.58 arc(41.04,47.29) 40.64,47.89 39.95,48.57 arc(39.93,48.61) U1.33
ENC.BR.A: length 73.5
  Bottom Layer w0.254: U1.7 72.17,47.88 arc(71.81,47.35) 71.69,46.72 71.69,42.37 arc(71.33,41.51) 70.47,41.16 8.39,41.16 arc(7.56,40.99) 6.86,40.52 6.14,39.8 arc(6.13,39.78) D24A-R.7
ENC.BR.B: length 71.4
  Bottom Layer w0.254: U1.10 70.4,42.85 arc(70.05,42.01) 69.22,41.67 7.06,41.67 arc(5.61,41.37) 4.37,40.55 D24A-R.9
ENC.FL.A: length 69.3
  Top Layer w0.254: D24A-L.7 6.87,47.65 arc(7.26,47.07) 7.39,46.38 7.39,43.6 arc(6.98,42.59) v4(5.97,42.17)
  Bottom Layer w0.254: v4(5.97,42.17) 60.11,42.17 arc(61.11,42.59) 61.52,43.58 61.52,46.48 arc(61.69,47.32) 62.17,48.03 U1.15
ENC.FL.B: length 68
  Bottom Layer w0.254: U1.17 59.48,47.89 arc(59.12,47.34) 58.99,46.69 58.99,43.76 arc(58.67,43) 57.91,42.68 6.96,42.68 arc(6.63,42.75) 6.35,42.94 arc(5.93,43.22) 5.43,43.32 3.31,43.32 arc(2.5,43.65) 2.16,44.47 2.16,46.1 arc(2.32,46.93) 2.79,47.63 3.54,48.38 arc(3.56,48.39) D24A-L.9
ENC.FR.A: length 85.6
  Top Layer w0.254: D24A-R.8 7.8,35.54 arc(9.04,34.72) 10.49,34.43 75.18,34.43 arc(76.26,34.87) 76.71,35.95 76.71,46.66 arc(76.84,47.33) 77.22,47.89 77.95,48.62 arc(77.98,48.64) U1.3
ENC.FR.B: length 87.2
  Top Layer w0.254: D24A-R.10 5.77,35.03 arc(7,34.21) 8.46,33.92 76.49,33.92 arc(77.57,34.37) 78.02,35.45 U1.4
I2C1.SCL: length 120.5
  Top Layer w0.305: v2(31.88,38.36) 28.93,41.31 arc(28.1,42.55) 27.81,44 27.81,59.07 arc(27.52,60.52) 26.7,61.76 IIC.1 ; v2(55.21,20.49) v2(55.21,25.66)
  Bottom Layer w0.305: v2(31.88,38.36) 31.88,24.27 arc(32.36,23.1) 33.53,22.61 53.09,22.61 arc(54.59,21.99) v2(55.21,20.49) 55.21,13.09 ; v2(55.21,25.66) 55.21,32.83 arc(55.8,34.24) 57.21,34.82 MPU6050.3
I2C1.SDA: length 120.8
  Top Layer w0.305: v2(28.45,62.42) 28.45,44.39 arc(28.74,42.93) 29.56,41.69 v2(32.89,38.36) ; v2(56.51,20.47) v2(56.51,25.66)
  Bottom Layer w0.305: U1.60 57.17,11.14 arc(56.68,11.86) 56.51,12.71 v2(56.51,20.47) arc(55.7,22.44) 53.73,23.25 34.04,23.25 arc(33.23,23.58) 32.89,24.39 v2(32.89,38.36) ; IIC.2 v2(28.45,62.42) ; v2(56.51,25.66) 56.51,30.44 arc(57.05,31.74) 58.36,32.28 MPU6050.4
I2C2.SCL: length 36.1
  Bottom Layer w0.254: U1.23 51.32,49.95 arc(50.79,50.3) 50.16,50.43 48.37,50.43 arc(47.21,50.66) 46.23,51.32 46.2,51.34 arc(44.96,52.17) 43.51,52.46 26.49,52.46 arc(25.45,52.89) 25.02,53.93 25.02,57.28 arc(24.82,58.28) 24.25,59.12 IIC.3
I2C2.SDA: length 36.8
  Bottom Layer w0.254: U1.24 51.94,46.79 arc(51.5,47.45) 51.35,48.22 51.35,48.74 arc(51,49.57) 50.16,49.92 48.28,49.92 arc(47.08,50.16) 46.06,50.84 45.88,51.02 arc(44.71,51.71) 43.38,51.95 25.11,51.95 arc(23.97,52.42) 23.5,53.56 IIC.4
LED: length 7.7
  Top Layer w0.305: LED2.2 LED.2 68.24,9.76 arc(68.16,10.19) U1.52
PWM0: length 38.7
  Top Layer w0.254: v4(13.72,43.44) 13.72,45.79 arc(13.72,45.83) D24A-L.2
  Bottom Layer w0.254: U1.28 47.54,44.38 arc(47.19,43.54) 46.35,43.19 14.33,43.19 arc(14,43.26) v4(13.72,43.44)
PWM1: length 37.8
  Top Layer w0.254: D24A-L.1 v4(13.74,51.44)
  Bottom Layer w0.254: v4(13.74,51.44) 43.17,51.44 arc(44.63,51.15) 45.86,50.33 U1.27
PWM2: length 76.8
  Bottom Layer w0.254: U1.1 81.05,48.16 arc(81.88,46.92) 82.17,45.47 82.17,43.95 arc(81.05,41.26) 78.36,40.14 18.24,40.14 arc(16.78,39.85) 15.55,39.03 D24A-R.2
PWM3: length 66.9
  Bottom Layer w0.254: U1.6 75.48,41.99 arc(75.09,41.04) 74.14,40.65 16.87,40.65 arc(16.66,40.61) 16.47,40.48 arc(16.29,40.36) 16.08,40.32 14.3,40.32 D24A-R.1
S: length 63.3
  Top Layer w0.254: v2(25.4,26.04) 11.94,26.04 11.3,25.41 arc(10.14,24.93) 9.65,23.76 9.65,18.18 arc(9.58,17.81) 9.37,17.5 R11.1 8.76,16.89 8.76,15.76 S.1 8,14.91 9.4,13.51 C5.2 ; v4(45.47,17.15) 44.82,17.8 arc(44.36,18.49) 44.2,19.31 44.2,23.76 arc(43.53,25.37) 41.91,26.04 v2(30.78,26.04)
  Bottom Layer w0.254: v4(45.47,17.15) 45.26,16.95 arc(44.36,16.35) 43.31,16.14 arc(42.44,15.96) 41.7,15.47 39.97,13.75 U1.73 ; v2(30.78,26.04) v2(25.4,26.04)
UART5.RX: length 95.6
  Top Layer w0.305: 75.53,13.09 75.53,24.81 arc(74.58,27.12) 72.26,28.08 31.17,28.08 arc(29.71,28.37) 28.47,29.19 v4(24.77,32.9) ; UART5.2 19.25,59.88 19.75,59.38 arc(20.17,58.75) 20.32,58.01 20.32,55.89 arc(20.67,54.13) 21.67,52.64 22.53,51.77 arc(24.18,49.3) 24.77,46.38 v4(24.77,38.49)
  Bottom Layer w0.305: v4(24.77,32.9) v4(24.77,38.49)
UART5.TX: length 101.5
  Top Layer w0.305: v4(25.65,32.9) 28.73,29.83 arc(29.96,29) 31.42,28.71 73.03,28.71 arc(75.72,27.6) 76.84,24.9 76.84,12.47 arc(76.96,11.84) 77.32,11.31 U1.44 ; UART5.3 19.8,61.07 arc(20.65,59.79) 20.95,58.28 20.95,56.02 arc(21.28,54.37) 22.21,52.98 23.42,51.77 arc(25.07,49.3) 25.65,46.38 v4(25.65,38.49)
  Bottom Layer w0.305: v4(25.65,32.9) v4(25.65,38.49)
UD+: length 10.1
  Top Layer w0.254: CH340K.1 36.15,8.6 ; 36.15,8.6 36.44,8.6 arc(36.8,8.45) 36.96,8.08 36.96,7.37 arc(36.95,7.37) USART1.B6 ; 36.15,8.6 arc(36,8.37) 35.94,8.1 USART1.A6
UD-: length 13.1
  Top Layer w0.299: USART1.B7 35.44,6.6 arc(35.63,6.16) 36.07,5.98 v4(36.45,5.98) 36.45,7.36 arc(36.45,7.36) USART1.A7
  Bottom Layer w0.254: v4(37.15,15.14) 36.66,14.65 arc(36.3,14.11) 36.17,13.48 36.17,6.65 arc(36.24,6.28) v4(36.45,5.98)
USART1.RX: length 105.8
  Top Layer w0.305: USART1#2.3 4.73,60.99 arc(5.55,59.75) 5.84,58.29 5.84,54.24 arc(6.25,53.25) 7.24,52.84 14.77,52.84 arc(18.07,51.48) 19.43,48.18 v2(19.43,38.49) ; v4(53.94,14.87) 53.94,12.67 arc(54.1,11.88) 54.54,11.22 55.21,10.55 ; RX.1 28.66,6.86 arc(28.97,7.33) 29.08,7.88 29.08,15.58 arc(29.37,17.03) 30.2,18.27 v2(30.48,18.55) 30.48,22.94 arc(30.19,24.4) 29.36,25.64 23.21,31.79 arc(21.98,32.61) 20.52,32.9 v2(19.43,32.9) ; v2(41.91,18.56) 41.91,16.68 arc(42.44,15.4) 43.72,14.87 v4(51.18,14.87)
  Bottom Layer w0.305: v2(19.43,38.49) v2(19.43,32.9) ; v2(30.48,18.55) 37.82,18.55 arc(37.83,18.55) 37.84,18.56 v2(41.91,18.56) ; v4(53.94,14.87) v4(51.18,14.87)
USART1.TX: length 101.2
  Top Layer w0.305: 26.48,6.21 25.93,6.76 arc(25.54,7.35) 25.4,8.03 25.4,13.16 arc(25.69,14.62) 26.52,15.86 v2(29.21,18.55) 29.21,23.32 arc(28.92,24.78) 28.09,26.02 23.09,31.02 arc(21.85,31.85) 20.39,32.14 v2(18.54,32.14) ; U1.63 52.67,14.65 arc(52.35,15.43) 51.56,15.76 44.93,15.76 arc(43.78,16.23) 43.31,17.38 v2(43.31,18.56) ; v2(18.54,38.49) 18.54,48.4 arc(17.43,51.09) 14.73,52.21 7.24,52.21 arc(5.8,52.8) 5.21,54.24 5.21,56.39 arc(4.92,57.85) 4.09,59.08 USART1#2.2
  Bottom Layer w0.305: v2(43.31,18.56) 43.06,18.8 arc(42.5,19.18) 41.83,19.31 31.05,19.31 arc(31.03,19.31) 31,19.31 arc(30.03,19.11) v2(29.21,18.55) ; v2(18.54,32.14) v2(18.54,38.49)
USART2.RX: length 55.5
  Top Layer w0.305: v4(22.99,27.06) 15.42,27.06 arc(13.96,27.35) 12.73,28.18 JY901S.4
  Bottom Layer w0.305: v4(22.99,27.06) 22.99,23.63 arc(23.47,22.46) 24.64,21.98 43.56,21.98 arc(45.9,21.01) 46.86,18.68 46.86,16.64 arc(46.79,16.28) 46.59,15.98 arc(46.42,15.72) 46.35,15.41 46.35,12.58 arc(46.5,11.85) 46.92,11.23 47.59,10.55
USART2.TX: length 50
  Top Layer w0.305: v4(22.1,27.95) 17.07,27.95 arc(15.61,28.24) 14.38,29.06 JY901S.3
  Bottom Layer w0.305: U1.69 45.05,14.57 arc(45.22,15.4) 45.69,16.11 45.72,16.14 arc(46.1,16.7) 46.23,17.36 46.23,18.68 arc(45.45,20.56) 43.56,21.34 24.51,21.34 arc(22.8,22.05) 22.1,23.76 v4(22.1,27.95)
USART3.RX: length 102
  Top Layer w0.305: v4(23.88,32.9) 28.22,28.56 arc(29.46,27.73) 30.91,27.44 71.63,27.44 arc(73.51,26.66) 74.29,24.77 74.29,12.47 arc(74.42,11.84) 74.78,11.3 75.53,10.55 ; USART3.3 14.88,60.94 arc(15.8,59.55) 16.13,57.92 arc(16.25,57.33) 16.58,56.84 21.64,51.77 arc(23.3,49.3) 23.88,46.38 v4(23.88,38.49)
  Bottom Layer w0.305: v4(23.88,32.9) v4(23.88,38.49)
USART3.TX: length 96.2
  Top Layer w0.305: U1.47 72.99,25.06 arc(72.48,26.29) 71.25,26.81 30.66,26.81 arc(29.2,27.1) 27.97,27.92 v4(22.99,32.9) ; v4(22.99,38.49) 22.99,46.38 arc(22.41,49.3) 20.75,51.77 15.97,56.55 arc(15.62,57.08) 15.49,57.71 arc(15.36,58.37) 14.99,58.94 14.04,59.88 USART3.2
  Bottom Layer w0.305: v4(22.99,32.9) v4(22.99,38.49)
USART6.RX: length 85.4
  Top Layer w0.305: v2(10.92,59.88) 10.92,55.13 arc(11.22,54.41) 11.94,54.11 14.73,54.11 arc(19.31,52.21) 21.21,47.63 v4(21.21,38.49)
  Bottom Layer w0.305: USART6.2 v2(10.92,59.88) ; 37.43,10.55 38.18,11.3 arc(38.56,11.87) 38.7,12.55 38.7,13.14 arc(38.89,14.11) 39.44,14.94 40.56,16.05 arc(41.35,16.59) 42.29,16.77 43.31,16.77 arc(44.74,17.37) 45.34,18.81 arc(44.78,20.15) 43.43,20.71 24.38,20.71 arc(22.14,21.64) 21.21,23.89 v4(21.21,38.49)
USART6.TX: length 83.5
  Top Layer w0.305: v4(20.32,38.49) 20.32,47.91 arc(18.69,51.84) 14.75,53.48 11.94,53.48 arc(10.77,53.96) 10.29,55.13 10.29,58.9 arc(10,60.36) 9.17,61.59 USART6.3
  Bottom Layer w0.305: v4(20.32,38.49) 20.32,23.89 arc(21.44,21.19) 24.13,20.08 43.43,20.08 arc(44.33,19.7) 44.7,18.81 arc(44.29,17.82) 43.31,17.41 42.29,17.41 arc(41.12,17.17) 40.12,16.51 37.43,13.82 37.43,13.09
$1N2281: length 1.6
  Top Layer w0.355: CH340K.10 36.15,22.72 arc(36.15,22.74) C4.1
$1N2282: length 14.4
  Top Layer w0.355: CH340K.9 37.15,23.83 arc(37.62,24.95) 38.74,25.41 41.53,25.41 arc(42.79,24.89) 43.31,23.63 R6.2
$1N2283: length 11.2
  Top Layer w0.355: CH340K.8 38.15,23.94 arc(38.36,24.44) 38.86,24.65 41.02,24.65 arc(41.65,24.39) 41.91,23.76 R7.2
$1N2289: length 1.4
  Top Layer w0.305: TX.2 26.47,9.19 arc(26.47,9.2) R8.1
$1N2292: length 1.4
  Top Layer w0.305: 28.01,7.81 28.01,9.2 arc(28,9.21) R9.1
$1N2301: length 11.1
  Top Layer w0.299: USART1.B5 37.94,5.44 arc(37.62,4.65) 36.83,4.33 31.12,4.33 arc(30.58,4.1) 30.35,3.56 R4.2
$1N2302: length 7.5
  Top Layer w0.299: USART1.A5 34.94,6 arc(34.64,5.27) 33.91,4.96 31.12,4.96 arc(30.58,5.19) 30.35,5.72 R5.2
$1N2368: length 1.2
  Top Layer w0.305: LED.1 71.01,4.46 arc(71.02,4.46) R13.1
$1N2391: length 3.7
  Top Layer w0.305: Q1.3 65.28,20.67 BUZZER.2
$1N2476: length 1.2
  Top Layer w0.305: LED2.1 71.01,2.93 arc(71.02,2.93) R10.1
$1N2481: length 1.6
  Top Layer w0.305: Q1.1 69.51,16.13 arc(69.5,16.06) R12.2
$1N2556: length 3
  Top Layer w0.381: R1.1 13.78,17.46 13.78,16.3 13.48,16 R2.2
$1N2557: length 1.6
  Top Layer w0.305: R3.1 24.32,6.34 arc(24.33,6.27) PWR#2.2

## Copper pours and planes (outline as drawn; the poured copper is in the pictures)
3V3 on Top Layer: 16.76,15.5 17.02,15.25 19.69,15.25 19.94,15.5 19.94,16.65 19.69,16.9 17.65,16.9 17.53,17.03 17.53,18.17 17.4,18.3 15.11,18.3 14.99,18.17 14.99,17.28 15.11,17.15 16.26,17.15 16.76,16.65
GND on Top Layer: -2.16,70.49 93.73,70.49 93.73,-1.9 -2.16,-1.9
GND on Bottom Layer: -2.16,71.13 93.47,71.13 93.47,-1.9 -2.16,-1.9
$1N2559 on Top Layer: 15.32,14.26 15.32,13.13 15.49,12.96 16.64,12.96 17.02,12.58 19.81,12.58 19.94,12.71 19.94,13.98 19.81,14.11 16.89,14.11 16.64,14.36 15.42,14.36

Small or netless copper shapes (teardrops, artwork), in the pictures only: 177 on Top Layer, 83 on Bottom Layer

## Text on the board
Bottom Silkscreen Layer: v1.0 | Designed By WilliTourt | NUEDC | TI-2025 Controller Platform
Top Silkscreen Layer: GND | 5V | D15 | D14 | B13 | B12 | E15 | E14 | E13 | E12 | E10 | E8 | C4 | A5 | A4 | 3V3 | D1 | A8 | D7 | D0 | B4 | D4 | E0 | B5 | C3 | E1 | C1 | C2 | E2 | C0 | E6 | E5 | C13 | C8 | D3 | C9 | I | VI | III | V | RX | TX | SCL1 | SDA1 | SCL2 | SDA2 | USART/UART | μVisionの0Error G.O.D. | STM32F407 LCKFB-TKX
